# EAGLE design falcoln (EAGLE 9.1.2)

## Sheet 1 of 5: Battery Charger
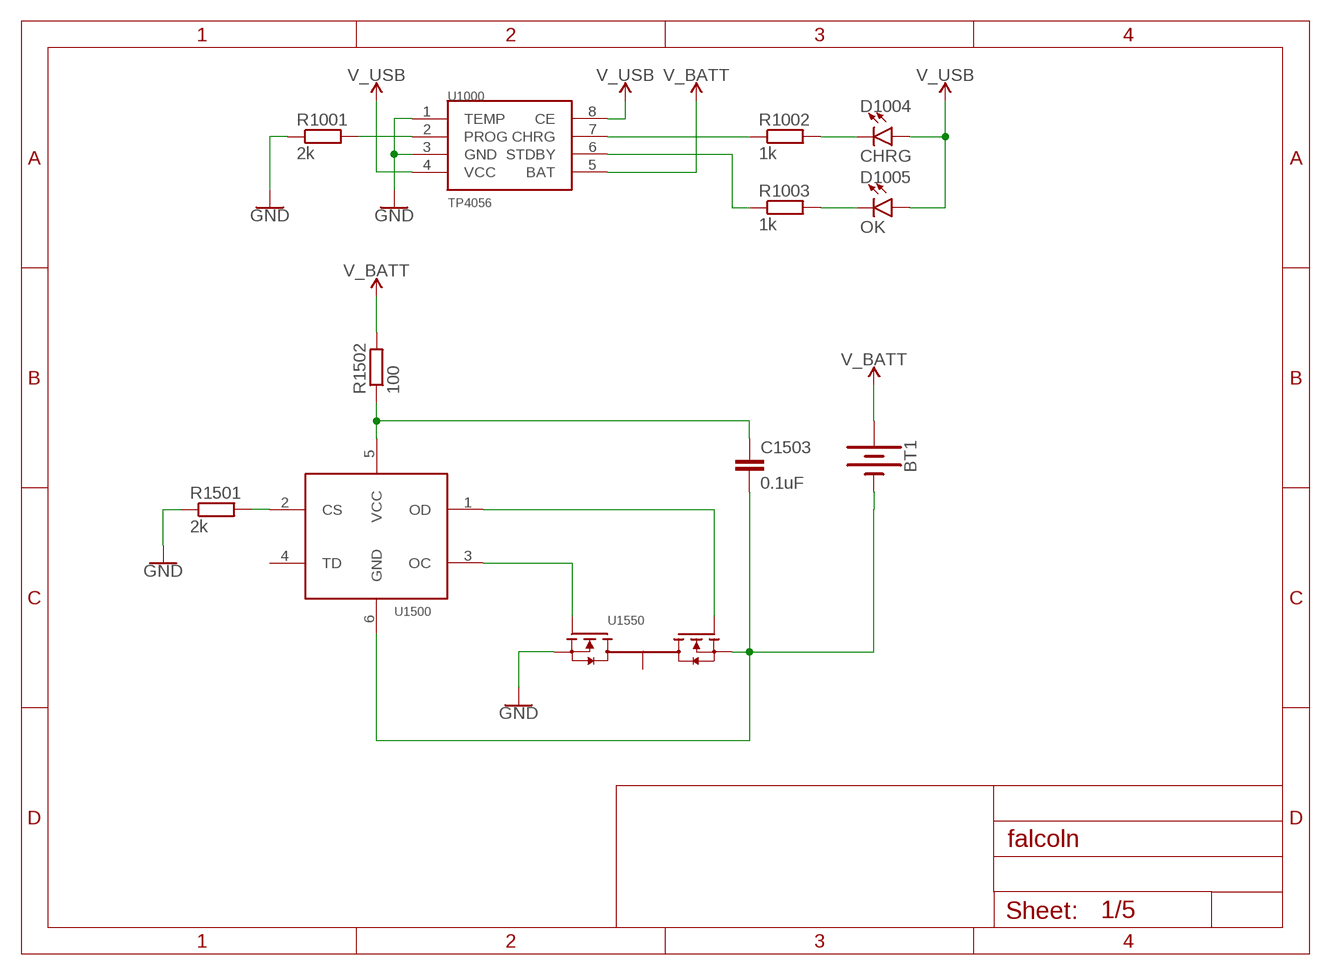
[diagram p0: schematic, sheet 1]

### Parts
BT1  BATTERY-18650  [BATTERY_18650-HOLDER]
C1503  0.1uF  C-EUC0603  [C0603]
D1004  CHRG  LED0603  [LED-0603]
D1005  OK  LED0603  [LED-0603]
R1001  2k  R-EU_R0603  [R0603]
R1002  1k  R-EU_R0603  [R0603]
R1003  1k  R-EU_R0603  [R0603]
R1501  2k  R-EU_R0603  [R0603]
R1502  100  R-EU_R0603  [R0603]
U1000  TP4056  [SOP-8]
U1500  FS312F-G  [SOT23-6]
U1550  FS8205  [SOT23-6]

### Nets
GND: R1001.1 R1501.1 U1000.1(TEMP) U1000.3(GND) U1550.1(S1) ; also sheet 2,3,4,5
N$1: U1500.3(OC) U1550.6(G1)
N$2: R1002.1 U1000.7(CHRG)
N$3: R1003.1 U1000.6(STDBY)
N$4: R1001.2 U1000.2(PROG)
N$5: BT1.GND@1(-) C1503.2 U1500.6(GND) U1550.3(S2)
N$6: D1005.C R1003.2
N$7: D1004.C R1002.2
N$8: U1500.1(OD) U1550.4(G2)
N$10: C1503.1 R1502.1 U1500.5(VCC)
N$11: R1501.2 U1500.2(CS)
V_BATT: BT1.PWR@1(+) R1502.2 U1000.5(BAT) ; also sheet 2,3
V_USB: D1004.A D1005.A U1000.4(VCC) U1000.8(CE) ; also sheet 5
Unconnected: U1500.4(TD) U1550.2(D12) U1550.5(D12)

## Sheet 2 of 5: Power Regulators
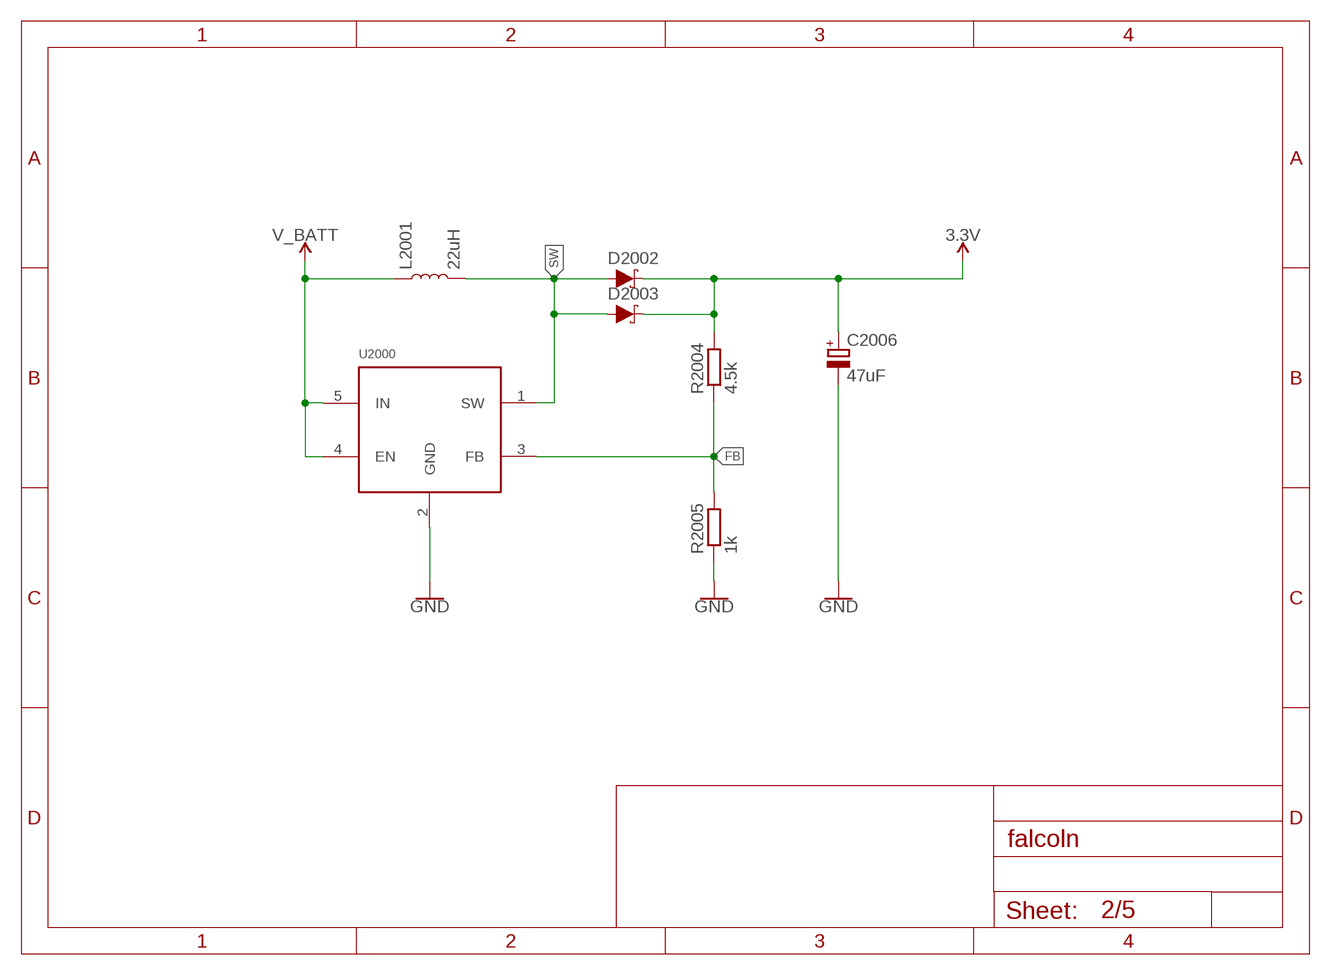
[diagram p1: schematic, sheet 2]

### Parts
C2006  47uF  CPOL-EUUD-5X5,8  [UD-5X5,8_NICHICON]
D2002  DIODE-SCHOTTKY-PMEG4005EJ  [SOD-323]
D2003  DIODE-SCHOTTKY-PMEG4005EJ  [SOD-323]
L2001  22uH  INDUCTOR-SRN6045-33UH  [SRN6045]
R2004  4.5k  R-EU_R0603  [R0603]
R2005  1k  R-EU_R0603  [R0603]
U2000  MT3608  [SOT23-6]

### Nets
3.3V: C2006.+ D2002.C D2003.C R2004.2 ; also sheet 3,4,5
FB: R2004.1 R2005.2 U2000.3(FB)
GND: C2006.- R2005.1 U2000.2(GND) ; also sheet 1,3,4,5
SW: D2002.A D2003.A L2001.2 U2000.1(SW)
V_BATT: L2001.1 U2000.4(EN) U2000.5(IN) ; also sheet 1,3

## Sheet 3 of 5: Processor
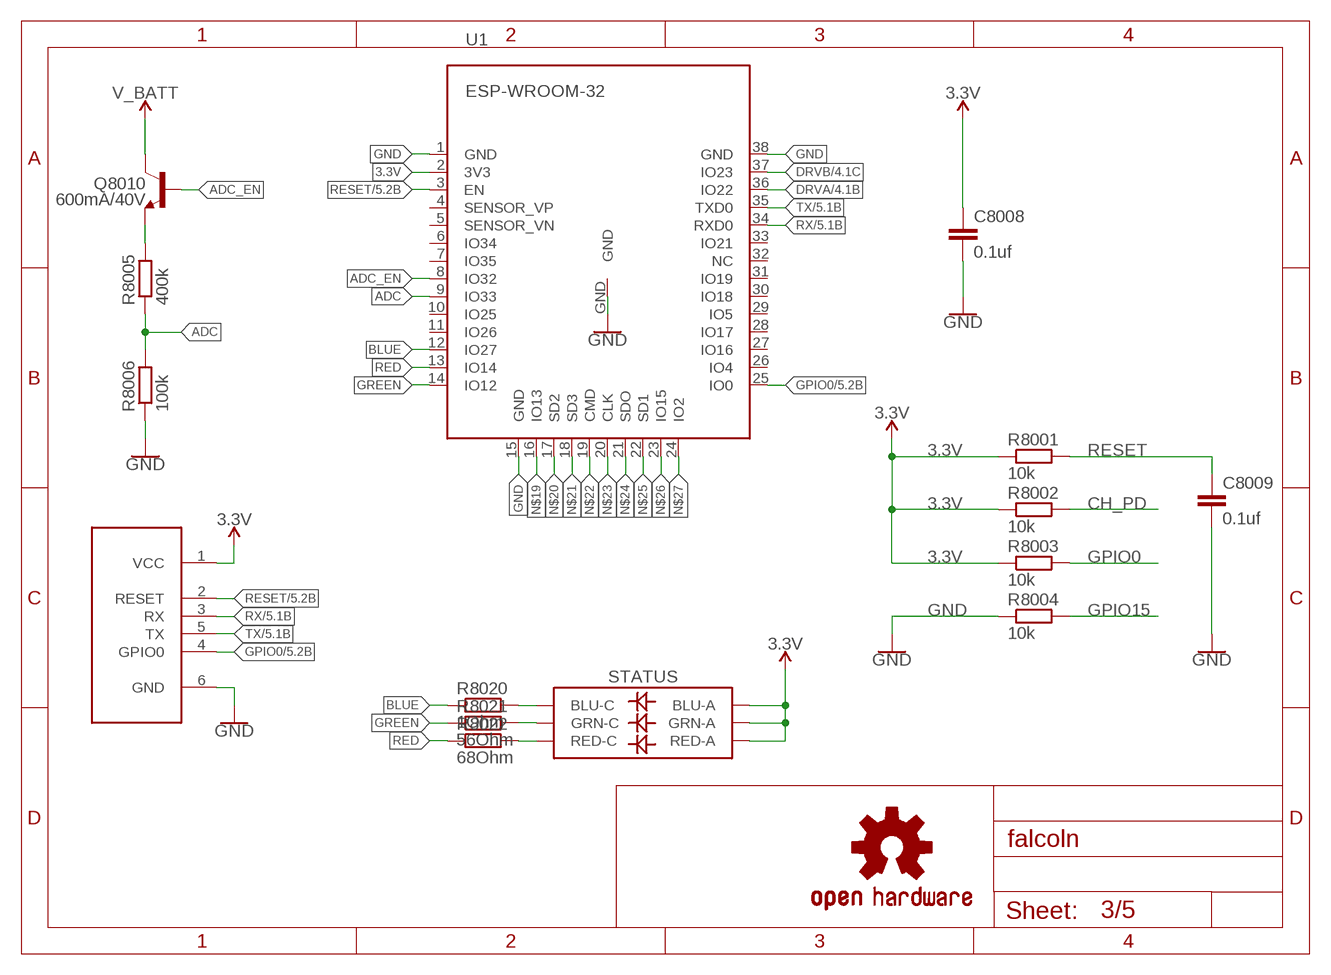
[diagram p2: schematic, sheet 3]

### Parts
C8008  0.1uf  C-EUC0603  [C0603]
C8009  0.1uf  C-EUC0603  [C0603]
LOGO1  OSHW-LOGOS  [OSHW-LOGO-S]
Q8010  600mA/40V  TRANS_NPN-MMBT2222AL  [SOT23-3]
R8001  10k  R-EU_R0603  [R0603]
R8002  10k  R-EU_R0603  [R0603]
R8003  10k  R-EU_R0603  [R0603]
R8004  10k  R-EU_R0603  [R0603]
R8005  400k  R-EU_R0603  [R0603]
R8006  100k  R-EU_R0603  [R0603]
R8020  1Ohm  R-EU_R0603  [R0603]
R8021  56Ohm  R-EU_R0603  [R0603]
R8022  68Ohm  R-EU_R0603  [R0603]
STATUS  LED-RGBNO_IC  [LED-TRICOLOR-5050]
U1  ESP-WROOM-32  [ESP-WROOM-32]
U$1  ESP8266_PROGRAMMER  [TC2030-IDC-NL]

### Nets
3.3V: C8008.1 R8001.1 R8002.1 R8003.1 STATUS.1(GRN-A) STATUS.2(RED-A) STATUS.3(BLU-A) U1.2(3V3) U$1.1(VCC) ; also sheet 2,4,5
ADC: R8005.1 R8006.2 U1.9(IO33)
ADC_EN: Q8010.1(B) U1.8(IO32)
BLUE: R8020.1 U1.12(IO27)
CH_PD: R8002.2
DRVA: U1.36(IO22) ; also sheet 4
DRVB: U1.37(IO23) ; also sheet 4
GND: C8008.2 C8009.2 R8004.1 R8006.1 U1.1(GND) U1.15(GND) U1.38(GND) U1.GND U$1.6(GND) ; also sheet 1,2,4,5
GPIO0: R8003.2 U1.25(IO0) U$1.4(GPIO0) ; also sheet 5
GPIO15: R8004.2
GREEN: R8021.1 U1.14(IO12)
N$9: Q8010.2(E) R8005.2
N$14: R8020.2 STATUS.4(BLU-C)
N$15: R8021.2 STATUS.6(GRN-C)
N$16: R8022.2 STATUS.5(RED-C)
N$19: U1.16(IO13)
N$20: U1.17(SD2)
N$21: U1.18(SD3)
N$22: U1.19(CMD)
N$23: U1.20(CLK)
N$24: U1.21(SDO)
N$25: U1.22(SD1)
N$26: U1.23(IO15)
N$27: U1.24(IO2)
RED: R8022.1 U1.13(IO14)
RESET: C8009.1 R8001.2 U1.3(EN) U$1.2(RESET) ; also sheet 5
RX: U1.34(RXD0) U$1.3(RX) ; also sheet 5
TX: U1.35(TXD0) U$1.5(TX) ; also sheet 5
V_BATT: Q8010.3(C) ; also sheet 1,2
Unconnected: U1.4(SENSOR_VP) U1.5(SENSOR_VN) U1.6(IO34) U1.7(IO35) U1.10(IO25) U1.11(IO26) U1.26(IO4) U1.27(IO16) U1.28(IO17) U1.29(IO5) U1.30(IO18) U1.31(IO19) U1.32(NC) U1.33(IO21)

## Sheet 4 of 5: Motor Driver
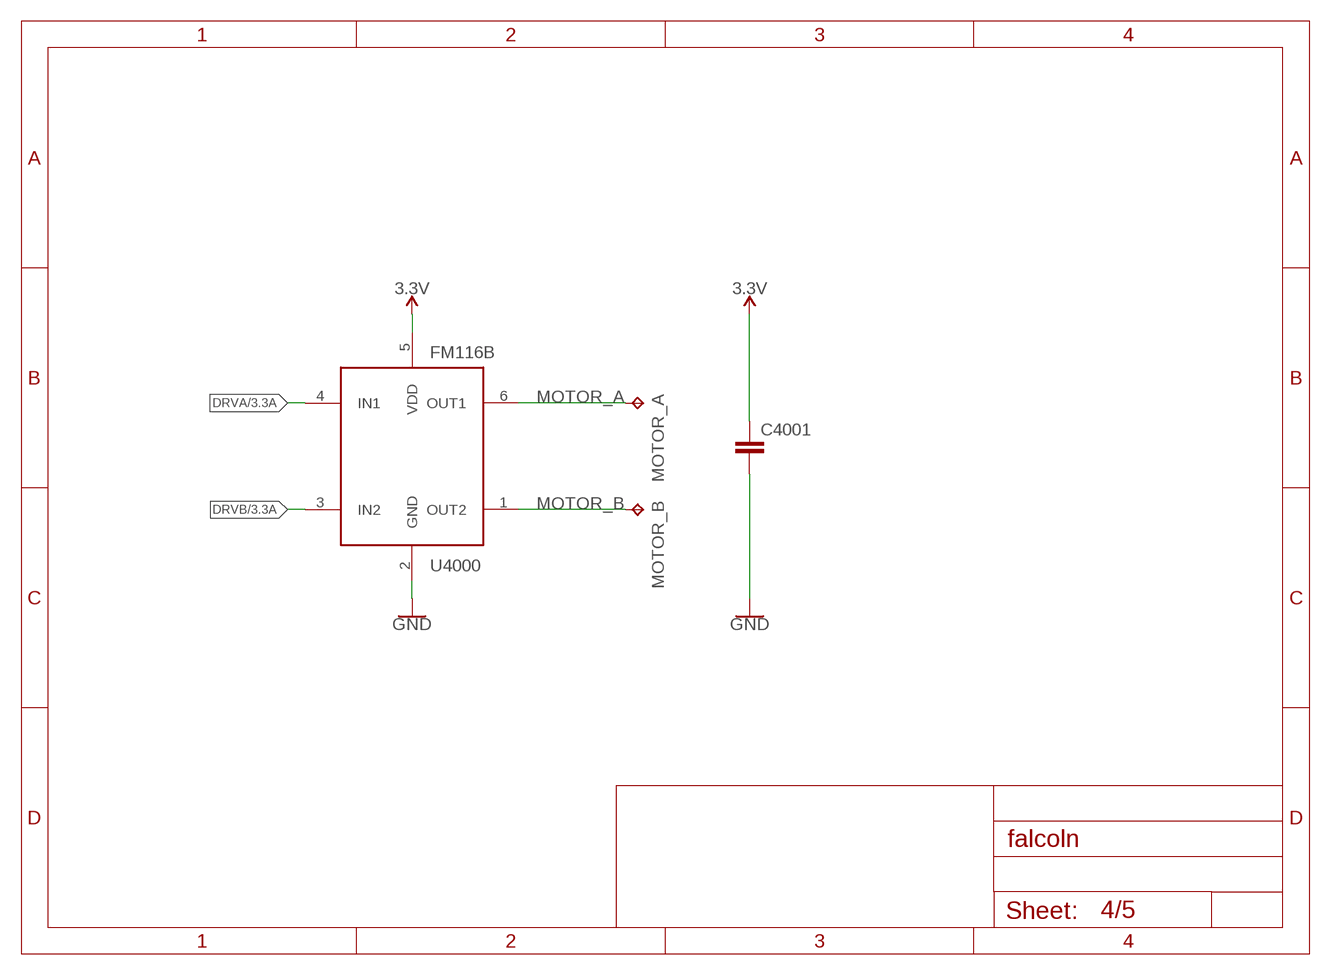
[diagram p3: schematic, sheet 4]

### Parts
C4001  C-EUC0603  [C0603]
MOTOR_A  TPTP20SQ  [TP20SQ]
MOTOR_B  TPTP20SQ  [TP20SQ]
U4000  FM116B  [SOT23-6]

### Nets
3.3V: C4001.1 U4000.5(VDD) ; also sheet 2,3,5
DRVA: U4000.4(IN1) ; also sheet 3
DRVB: U4000.3(IN2) ; also sheet 3
GND: C4001.2 U4000.2(GND) ; also sheet 1,2,3,5
MOTOR_A: MOTOR_A.TP U4000.6(OUT1)
MOTOR_B: MOTOR_B.TP U4000.1(OUT2)

## Sheet 5 of 5: USB/UART
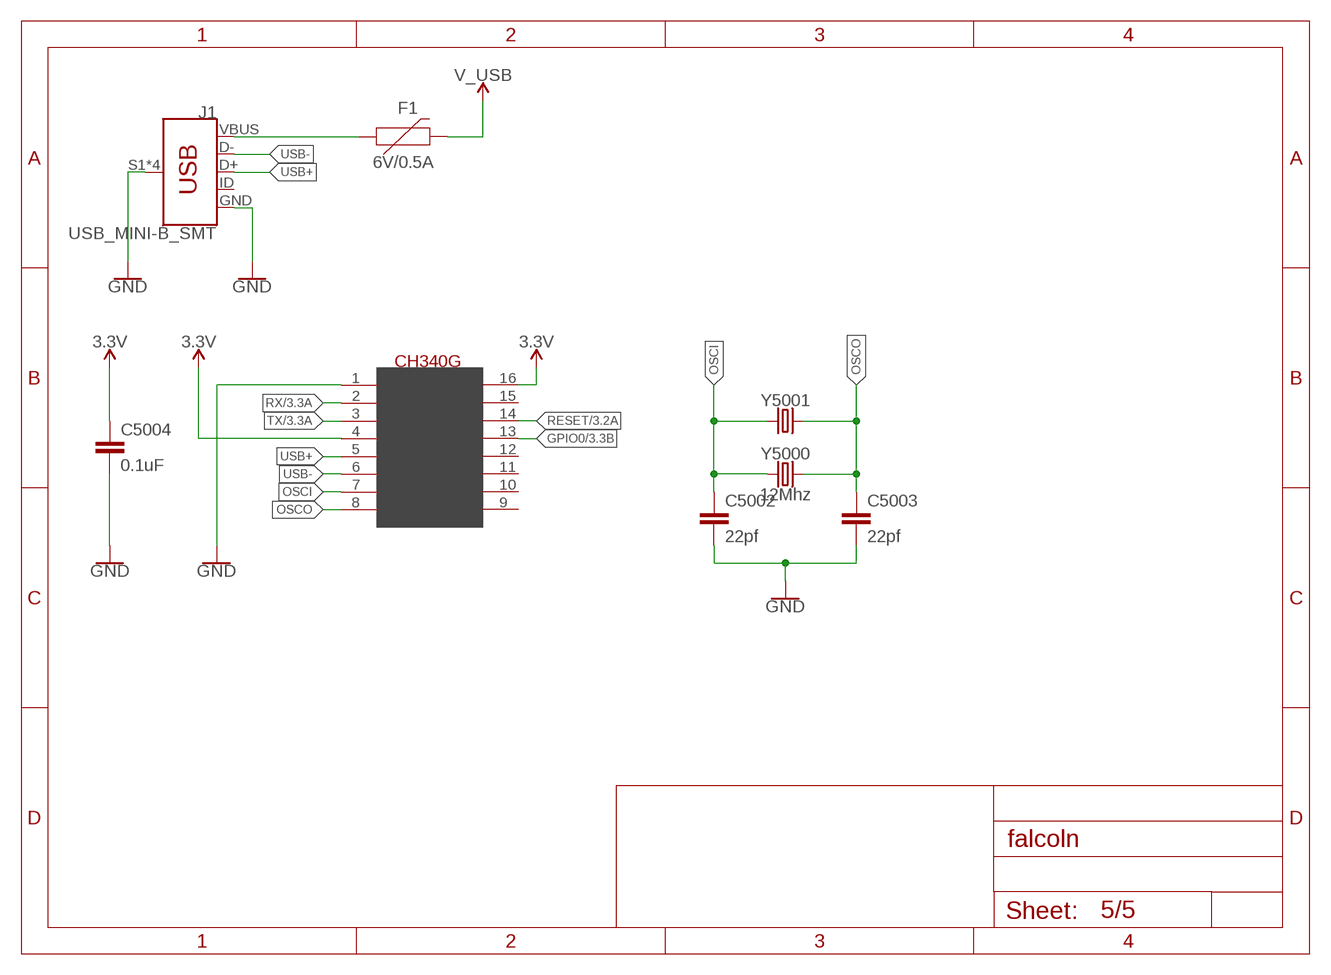
[diagram p4: schematic, sheet 5]

### Parts
C5002  22pf  C-EUC0603  [C0603]
C5003  22pf  C-EUC0603  [C0603]
C5004  0.1uF  C-EUC0603  [C0603]
F1  6V/0.5A  PPTC_HALF-AMP  [1206]
J1  USB_MINI-B_SMT  [USB-MINIB]
U5000  CH340G  [SOIC16]
Y5000  12Mhz  CRYSTALSMD-HC49UP  [HC49UP]
Y5001  CRYSTALPTH-HC49UV  [HC49U]

### Nets
3.3V: C5004.1 U5000.4(V3) U5000.16(VCC) ; also sheet 2,3,4
GND: C5002.2 C5003.2 C5004.2 J1.GND J1.S1(SHIELD) J1.S2(SHIELD) J1.S3(SHIELD) J1.S4(SHIELD) U5000.1(GND) ; also sheet 1,2,3,4
GPIO0: U5000.13(DTR) ; also sheet 3
OSCI: C5002.1 U5000.7(XI) Y5000.1 Y5001.1
OSCO: C5003.1 U5000.8(XO) Y5000.2 Y5001.2
RESET: U5000.14(RTS) ; also sheet 3
RX: U5000.2(TX) ; also sheet 3
TX: U5000.3(RX) ; also sheet 3
USB+: J1.D+ U5000.5(D+)
USB-: J1.D- U5000.6(D-)
V_USB: F1.2 ; also sheet 1
V_USB_UNFUSED: F1.1 J1.VBUS
Unconnected: J1.ID U5000.9(CTS) U5000.10(DSR) U5000.11(RI) U5000.12(DCD) U5000.15(RS232)

## Library data of the parts
BT1 = SparkFun-Batteries:BATTERY: Battery - Single Cell A variety of battery chemistries, sizes, and footprints. Device List: 20MM_PTH - Coin Cell Battery Holder - 20mm (PTH) <https://www.sparkfun.com/products/783> 6.8MM_PTH - Coin Cell Battery Holder - 6.8MM(SMD) <https://www.digikey.com/product-detail/en/seiko-instruments/MS621FE-FL11E/728-1057-ND/1889208?WT.srch=1&gclid=CNOQ5a6LzdQCFZS2wAodXCkE0g> 12MM_SMD - Coin Cell Battery Holder - 12mm (SMD) <https://www.sparkfun.com/products/10592> 12MM_PTH - Coin Cell Battery Holder - 12mm (PTH) <https://www.sparkfun.com/products/7948> 20MM_SMD - 20mm Coin Cell Battery Holder (SMD) (2 legs) Used on the Big Time Watch Kit <https://www.sparkfun.com/products/11734> 20MM_SMD_4LEGS - Coin Cell Battery Holder - 20mm (SMD) <https://www.sparkfun.com/products/11892> 20MM_SMD_4LEGS_OVERPASTE - Coin Cell Battery Holder - 20mm (SMD) <https://www.sparkfun.com/products/11892> (Over-paste on the legs) 24.5MM_PTH - Coin Cell Battery Holder - 24.5mm (PTH) <https://www.sparkfun.com/products/8863> 9V - 9V Battery Holder - PC Mount Used on the SparkFun SparkPunk Sound Kit <https://www.sparkfun.com/products/11177> and SparkFun SparkPunk Sequencer Kit <https://www.sparkfun.com/products/12707> 18650 - Battery Holder - 18650 (PTH) <https://www.sparkfun.com/products/13113> AA - Battery Holder - 1xAA (PTH) <https://www.sparkfun.com/products/7949> AAA - Battery Holder - 1xAAA (PTH) <https://www.sparkfun.com/products/12718> AA_KIT - Battery Holder - 1xAA (PTH) <https://www.sparkfun.com/products/7949> Special kit package - pads only have exposed copper on one side of the board. AAA_KIT - Battery Holder - 1xAAA (PTH) <https://www.sparkfun.com/products/12718> Special kit package - pads only have exposed copper on one side of the board.; PROD_ID: BATT-12327; SF_SKU: PRT-13113
C1503 C4001 C5002-C5004 C8008 C8009 = rcl:C-EU: CAPACITOR, European symbol; SPICEPREFIX: C
C2006 = rcl:CPOL-EU: POLARIZED CAPACITOR, European symbol; SPICEPREFIX: C
D1004 D1005 = SparkFun-LED:LED: LED (Generic) Standard schematic elements and footprints for 5mm, 3mm, 1206, and 0603 sized LEDs. Generic LEDs with no color specified.
D2002 D2003 = SparkFun-DiscreteSemi:DIODE-SCHOTTKY: Schottky diode A Schottky diode is a semiconductor diode which has a low forward voltage drop and a very fast switching action.; PROD_ID: DIO-10955; VALUE: 0.5A/40V/420mV
F1 = SparkFun-Fuses:PPTC: Resettable Fuse PPTC Resettable Fuse. Really a sort of resistor with a polymeric positive temperature coefficient whose resistance increases dramatically with an increase in temperature. When heated by the power passing through the resistance rises causing the current to be limited, protecting the circuit. This is achieved by the transition of the polymer from a crystalline to an amorphous state where the conductive carbon separates breaking the conductive pathways found in the cool crystalline structure. When a PPTC cools back down it resumes conducting letting the circuit turn back on. SparkFun Products: SparkFun RedBoard - Programmed with Arduino <https://www.sparkfun.com/products/12757> Pro Micro - 5V/16MHz <https://www.sparkfun.com/products/12640> Arduino Pro 328 - 5V/16MHz <https://www.sparkfun.com/products/10915> MP3 Trigger <https://www.sparkfun.com/products/13720>; PROD_ID: RES-08585
J1 = SparkFun-Connectors:USB_MINI-B: USB type Mini-B Connector Breaks out 5th pin, and includes shield pins if needed. SparkFun Products: SparkFun FTDI Basic Breakout <https://www.sparkfun.com/products/9716> SparkFun XBee Explorer USB <https://www.sparkfun.com/products/11812> SparkFun Redboard <https://www.sparkfun.com/products/12757>; PROD_ID: CONN-08193; SF_ID: PRT-00587
L2001 = SparkFun-Coils:INDUCTOR: Inductors Resist changes in electrical current. Basically a coil of wire. SparkFun Products: SparkFun Load Cell Amplifier - HX711 <https://www.sparkfun.com/products/13879> IOIO-OTG - V2.2 <https://www.sparkfun.com/products/13613>; PROD_ID: NDUC-11627; VALUE: 33µH/±20%/1.4A
LOGO1 = SparkFun-Aesthetics:OSHW-LOGO: Open-Source Hardware (OSHW) Logo This logo indicates the piece of hardware it is found on incorporates a OSHW license and/or adheres to the definition of open source hardware found here: http://freedomdefined.org/OSHW
MOTOR_A MOTOR_B = testpad:TP: Test pad
Q8010 = SparkFun-DiscreteSemi:TRANS_NPN: NPN transistor Current controlled devices typically used to amplify current or used as a switch. BC547 - COM-08928 <http://www.sparkfun.com/products/8928> (TO-92 45V 100mA) (1.Collector 2.Base 3.Emitter) 2N3904 - COM-00521 <http://www.sparkfun.com/products/521> (TO-92 40V 200mA) (1.Emitter 2.Base 3.Collector) P2N2222A - COM-12852 <http://www.sparkfun.com/products/12852> (TO-92 40V 600mA) (1.Collector 2.Base 3.Emitter); PROD_ID: TRANS-08049
R1001-R1003 R1501 R1502 R2004 R2005 R8001-R8006 R8020-R8022 = rcl:R-EU_: RESISTOR, European symbol; SPICEPREFIX: R
STATUS = SparkFun-LED:LED-RGB: LED-RGB 6 pin RGB LED (no common connector) Packages: PLCC-6 LED-TRICOLOR-5050 - No built-in IC SparkFun Products: Digital Sandbox <https://www.sparkfun.com/products/12651> LED- SMD RGB <https://www.sparkfun.com/products/10866>; PROD_ID: DIO-10298
U1 = esp32:ESP-WROOM-32
U1000 = geusebio:TP4056
U1500 = geusebio:FS312F-G
U1550 = geusebio:FS8205
U2000 = geusebio:MT3608
U4000 = geusebio:FM116B
U5000 = CH340G-USB-SERIAL:CH340G
U$1 = geusebio:ESP8266_PROGRAMMER
Y5000 Y5001 = SparkFun-Clocks:CRYSTAL: Crystals (Generic) These are passive quartz crystals, which can be used as a clock source for a microcontroller. Crystal's are two-terminal devices. They require external "load" capacitors to generate an oscillating signal.

## Board
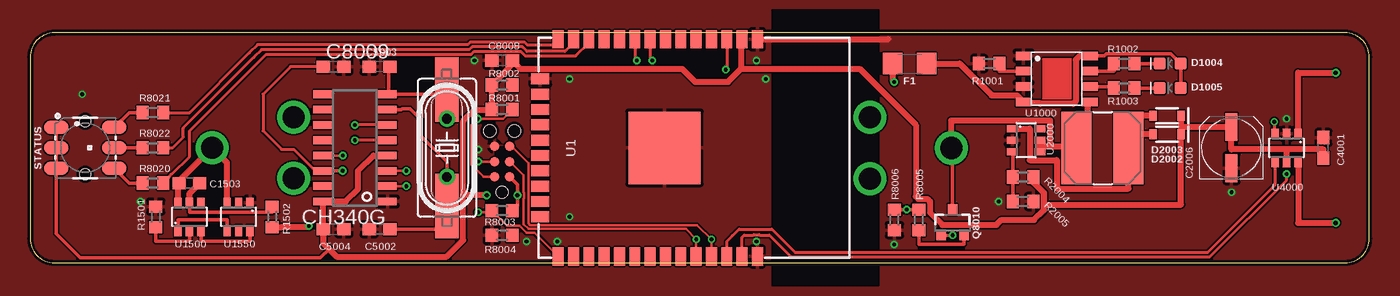
[diagram p5: board, top side]
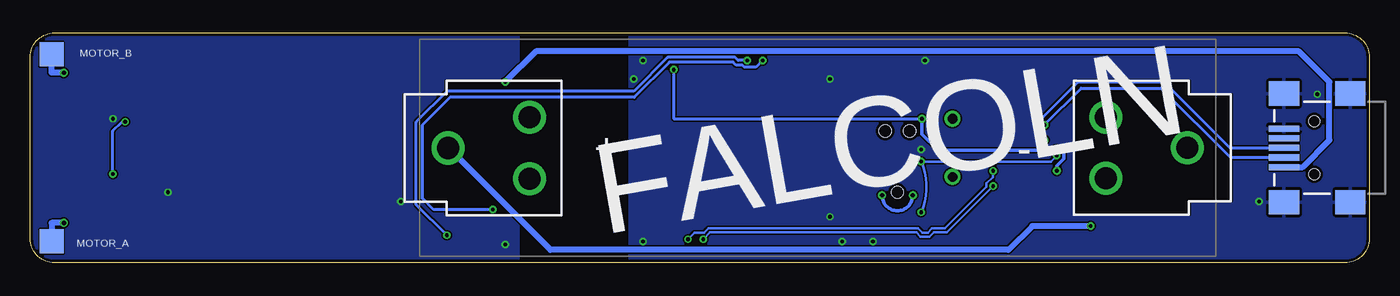
[diagram p6: board, bottom side, seen from below]

Size 111 x 19.05 mm. Coordinates in mm from the lower left corner, seen from the top.
Outline: 0,17.05 0,2 arc90 2,0 109,0 arc90 111,2 111,17.05 arc90 109,19.05 2,19.05 arc90 0,17.05
Copper layers (1*16): Top 0.035mm / dielectric 1.5mm / Bottom 0.035mm
Design rules "dirtypcbs": minimum track width 5mil, minimum drill 12mil, track to track 5mil, track to pad 5mil, pad to pad 5mil, via to via 5mil, smd to smd 0mil, copper to edge 10mil, drill to drill 10mil, minimum pad ring 10mil, minimum via ring 6mil, stop-mask expansion 2mil, vias tented up to drill 25mil, thermal gap 10mil
tKeepout: area 0,17.8 to 111,19; area 0,0 to 111,1.3
bKeepout: area 81,0 to 111,19.1

### Footprints (pad centres in the part's own frame; a part is rotated, then mirrored left to right if it is on the bottom)
BATTERY_18650-HOLDER = drill 1.829: GND@1 30.628,0.01; GND@2 23.88,2.55; GND@3 23.88,-2.53; PWR@1 -30.628,-0.01; PWR@2 -23.88,2.53; PWR@3 -23.88,-2.55
C0603 = smd 1.1 x 1: 1 -0.85,0; 2 0.85,0
UD-5X5,8_NICHICON = smd 2.3 x 1: + 1.725,0; - -1.7,0
LED-0603 = smd 1 x 1: A -0.877,0; C 0.877,0
SOD-323 = smd 0.63 x 0.83: A 1.15,0; C -1.15,0
1206 = smd 1.6 x 1.8: 1 -1.4,0; 2 1.4,0
USB-MINIB = smd 2.5 x 0.5: D+ 2.5,0; D- 2.5,0.8; GND 2.5,-1.6; ID 2.5,-0.8; VBUS 2.5,1.6 | smd 2.5 x 2: S1 -3,4.5; S2 2.5,4.5; S3 -3,-4.5; S4 2.5,-4.5 | hole 0.9: 0,2.2; 0,-2.2
SRN6045 = smd 2.5 x 6: 1 -2.175,0; 2 2.125,0
TP20SQ = smd 2 x 2: TP 0,0
SOT23-3 = smd 0.8 x 0.9: 1 -0.95,-1; 2 0.95,-1; 3 0,1.1
R0603 = smd 1 x 1.1: 1 -0.85,0; 2 0.85,0
LED-TRICOLOR-5050 = smd 2 x 1.1: 1 -2.4,1.7; 2 -2.4,0; 3 -2.4,-1.7; 4 2.4,-1.7; 5 2.4,0; 6 2.4,1.7
ESP-WROOM-32 = smd 0.9 x 1.5: 1 7.7,9; 2 6.43,9; 3 5.16,9; 4 3.89,9; 5 2.62,9; 6 1.35,9; 7 0.08,9; 8 -1.19,9; 9 -2.46,9; 10 -3.73,9; 11 -5,9; 12 -6.27,9; 13 -7.54,9; 14 -8.81,9; 25 -8.81,-9; 26 -7.54,-9; 27 -6.27,-9; 28 -5,-9; 29 -3.73,-9; 30 -2.46,-9; 31 -1.19,-9; 32 0.08,-9; 33 1.35,-9; 34 2.62,-9; 35 3.89,-9; 36 5.16,-9; 37 6.43,-9; 38 7.7,-9 | smd 1.5 x 0.9: 15 -10.3,5.715; 16 -10.3,4.445; 17 -10.3,3.175; 18 -10.3,1.905; 19 -10.3,0.635; 20 -10.3,-0.635; 21 -10.3,-1.905; 22 -10.3,-3.175; 23 -10.3,-4.445; 24 -10.3,-5.715 | smd 6 x 6: GND 0,0
SOP-8 = smd 1.3 x 0.7: 1 -2.75,1.905; 2 -2.75,0.635; 3 -2.75,-0.635; 4 -2.75,-1.905; 5 2.75,-1.905; 6 2.75,-0.635; 7 2.75,0.635; 8 2.75,1.905
SOT23-6 = smd 0.6 x 0.9: 1 -0.95,-1.15; 2 0,-1.15; 3 0.95,-1.15; 4 0.95,1.15; 5 0,1.15; 6 -0.95,1.15
SOIC16 = smd 0.635 x 1.524: 1 -4.445,-2.695; 2 -3.175,-2.695; 3 -1.905,-2.695; 4 -0.635,-2.695; 5 0.635,-2.695; 6 1.905,-2.695; 7 3.175,-2.695; 8 4.445,-2.695; 9 4.445,2.695; 10 3.175,2.695; 11 1.905,2.695; 12 0.635,2.695; 13 -0.635,2.695; 14 -1.905,2.695; 15 -3.175,2.695; 16 -4.445,2.695
TC2030-IDC-NL = smd 0.787 x 0.787: 1 -1.27,-0.635; 2 -1.27,0.635; 3 0,-0.635; 4 0,0.635; 5 1.27,-0.635; 6 1.27,0.635 | hole 0.991: -2.54,0; 2.54,1.016; 2.54,-1.016
HC49UP = smd 5.334 x 1.93: 1 -4.826,0; 2 4.826,0
HC49U = drill 0.813: 1 -2.413,0; 2 2.413,0

### Placement (x,y rotation side)
BT1  45.72,9.53 0 bottom
C1503  13.21,6.6 180 top
C2006  99.57,9.53 90 top
C4001  107.19,9.53 90 top
C5002  28.96,2.79 180 top
C5003  28.96,16.26 180 top
C5004  25.15,2.79 0 top
C8008  39.12,16.76 180 top
C8009  25.15,16.26 0 top
D1004  94.49,16.51 180 top
D1005  94.49,14.48 180 top
D2002  94.23,12.19 180 top
D2003  94.23,10.67 180 top
F1  72.9,16.51 0 top
J1  4.57,9.53 180 bottom
L2001  88.9,9.53 0 top
LOGO1  -15.24,90.17 0 top  (outside the outline)
MOTOR_A  109.22,1.78 0 bottom
MOTOR_B  109.22,17.27 0 bottom
Q8010  76.45,3.3 0 top
R1001  79.5,16.51 0 top
R1002  90.68,16.51 0 top
R1003  90.68,14.48 0 top
R1501  10.41,3.81 270 top
R1502  20.07,3.81 270 top
R2004  82.3,7.11 0 top
R2005  82.3,5.08 180 top
R8001  39.12,12.7 0 top
R8002  39.12,14.73 0 top
R8003  39.12,4.32 180 top
R8004  39.12,2.29 0 top
R8005  73.66,3.56 270 top
R8006  71.63,3.56 90 top
R8020  10.16,6.6 180 top
R8021  10.16,12.45 180 top
R8022  10.16,9.53 180 top
STATUS  4.57,9.53 0 top
U1  52.58,9.53 0 top
U1000  85.09,15.24 0 top
U1500  13.21,3.81 0 top
U1550  17.27,3.81 180 top
U2000  82.55,10.16 270 top
U4000  104.14,9.53 180 top
U5000  26.92,9.53 90 top
U$1  39.12,8.38 90 top
Y5000  34.54,9.53 90 top
Y5001  34.54,9.53 90 top

### Tracks (layer width: path | path; a pad name or v marks a point on that pad's centre or on a via)
3.3V  (via drill 0.35)
  Top 0.254: U$1.1 39.86,7
  Top 0.305: R8003.1 40.39,4.74 v40.39,5.59 40.39,6.48 39.86,7 | STATUS.1 STATUS.2 STATUS.3 2.17,2.4 4.17,0.41 24.03,0.41 24.77,1.14
  Top 0.508: D2002.C 95.38,11.18 | 95.38,11.18 D2003.C 95.38,4.83 84.03,4.83 84.03,5.79 | 35.89,5.59 35.89,1.87 34.52,0.51 25.4,0.51 24.77,1.14 24.3,1.61 C5004.1 24.3,5.01 U5000.16 26.16,5.08 27.18,6.1 27.18,7.62 28.45,8.89 U5000.4 | v37.85,5.59 35.89,5.59 | 35.89,5.59 35.89,11.76 36.83,12.7 R8001.1 R8002.1 39.97,16.43 C8008.1 40.66,16.07 54.03,16.07 55.12,14.99 57.84,14.99 58.93,16.07 | R2004.2 83.15,6.67 84.03,5.79 | 84.03,5.79 84.03,4.37 83.21,3.56 80.52,3.56 80.09,3.13 75.61,3.13 74.59,4.15 74.59,5.06 74.37,5.29 73.62,5.29 73.41,5.5 73.41,11.43 68.77,16.07 58.93,16.07 | U1.2 58.93,18.52 58.93,16.07 | 95.38,11.18 95.38,11.25 C2006.+ 99.57,9.4 104.14,9.4 | U4000.5 104.14,9.4 | C4001.1 107.19,9.4 104.14,9.4
  Bottom 0.305: v37.85,5.59 arc180 v40.39,5.59
ADC  (via drill 0.3)
  Top 0.254: U1.9 50.12,16.94 v50.29,16.76
  Top 0.305: R8005.1 v72.64,4.41 R8006.2
  Bottom 0.254: v50.29,16.76 50.85,16.2 51.79,16.2 51.97,16.38 52.48,16.38 52.74,16.64 58.01,16.64 60.93,13.72 76.2,13.72 78.49,11.43 78.49,5.33 77.56,4.41 76.96,4.41 | v72.64,4.41 76.96,4.41 | 76.96,4.41
ADC_EN  (via drill 0.3)
  Top 0.254: U1.8 51.39,16.94 v51.56,16.76 | Q8010.1 75.52,2.29 v76.45,2.29
  Bottom 0.254: v51.56,16.76 52.32,16.76 52.58,17.02 58.17,17.02 60.96,14.22 76.45,14.22 78.99,11.68 78.99,4.83 v76.45,2.29
BLUE
  Top 0.254: U1.12 46.31,18.24 45.21,17.14 41.03,17.14 40.65,17.52 36.79,17.52 36.55,17.27 19.56,17.27 13.21,10.92 13.21,8.8 11.76,7.36 11.7,7.36 11.55,7.21 11.55,7.15 R8020.1
DRVA
  Top 0.254: U4000.4 103.19,6.45 97.63,0.89 63.37,0.89 61.47,2.79 58.75,2.79 58.21,2.25 57.74,1.78 U1.36
DRVB  (via drill 0.3)
  Top 0.254: U1.37 59.01,2.11 59.18,2.29 59.92,2.29 59.97,2.34 60.43,2.34 60.48,2.29 61.28,2.29 63.06,0.51 97.79,0.51 104.14,6.86 v104.14,7.37 | v103.12,11.68 103.12,10.74 U4000.3
  Bottom 0.254: v104.14,7.37 104.14,10.92 103.38,11.68 v103.12,11.68
FB
  Top 0.305: U2000.3 81.45,9.21 R2004.1 R2005.2
GND  (via drill 0.3)
  Top 0.508: U1.1 71.14,18.52
  other vias: 44.7,15.24 36.83,16.76 41.15,1.78 43.69,1.78 9.14,5.08 4.32,13.97 60.2,16.76 60.2,1.78 80.26,5.08 71.63,1.52 44.7,3.81 37.13,9.4 104.14,11.94 99.57,5.84 60.96,15.24
  pour Top: -7.62,37.08 123.44,37.08 123.44,-16.76 -7.62,-16.76
  pour Bottom: -5.59,35.05 126.49,35.05 126.49,-19.56 -5.33,-19.56 -5.33,34.8
GPIO0  (via drill 0.3)
  Top 0.203: U1.25 41.82,2.47 41.15,2.47 40.56,3.06 39.52,3.06 R8003.2 38.14,4.19 v37.13,4.19 | U$1.4 37.34,8.38 v37.13,8.38 | v25.91,8.89 U5000.13
  Bottom 0.203: v25.91,8.89 26.42,8.38 v37.13,8.38 arc45 v37.13,4.19
GREEN
  Top 0.254: R8021.1 13.21,12.45 18.16,17.4 18.84,18.08 36.28,18.08 36.48,18.28 40.96,18.28 41.21,18.03 43.28,18.03 U1.14
MOTOR_A  (via drill 0.35)
  Top 0.508: U4000.6 105.09,3.3 v108.2,3.3
  Bottom 0.508: v108.2,3.3 109.22,3.3 MOTOR_A.TP
MOTOR_B  (via drill 0.35)
  Top 0.508: U4000.1 105.09,15.75 v108.2,15.75
  Bottom 0.508: v108.2,15.75 109.22,15.75 MOTOR_B.TP
N$1
  Top 0.305: U1500.3 14.16,1.78 18.22,1.78 U1550.6
N$2
  Top 0.305: U1000.7 89.83,15.88 R1002.1
N$3
  Top 0.305: U1000.6 89.83,14.61 R1003.1
N$4
  Top 0.305: U1000.2 80.35,15.88 R1001.2
N$5
  Top 0.508: U1500.6 12.26,6.5 C1503.2 12.36,6.8 12.94,7.38 BT1.GND@1 16.32,8.3 U1550.3
N$6
  Top 0.305: R1003.2 D1005.C
N$7
  Top 0.305: R1002.2 D1004.C
N$8
  Top 0.305: U1500.1 12.26,3.56 16.32,3.56 U1550.4
N$9
  Top 0.305: R8005.2 73.66,1.52 77.4,1.52 Q8010.2
N$10
  Top 0.305: U1500.5 13.21,4.21 20.07,4.21 R1502.1
  Top 0.508: U1500.5 13.21,5.75 C1503.1
N$11
  Top 0.305: U1500.2 13.21,1.78 10.41,1.78 R1501.2
N$14
  Top 0.305: STATUS.4 8.19,6.6 R8020.2
N$15
  Top 0.305: STATUS.6 8.19,12.45 R8021.2
N$16
  Top 0.305: STATUS.5 R8022.2
OSCI
  Top 0.305: Y5000.1 34.54,5.08 | 34.54,5.08 Y5001.1 34.54,8.38 32.42,10.5 32.42,11.85 31.5,12.78 30.81,12.78 30.73,12.7 U5000.7 | C5002.1 34.54,2.79 34.54,5.08
OSCO
  Top 0.305: Y5000.2 34.54,13.97 | 34.54,13.97 Y5001.2 | U5000.8 29.72,13.97 | 29.72,13.97 34.54,13.97 | C5003.1 29.72,16.26 29.72,13.97
RED
  Top 0.254: R8022.1 11.81,9.53 12.7,10.41 12.7,11.18 18.54,17.02 19.18,17.65 36.39,17.65 36.64,17.9 40.81,17.9 41.18,17.52 44.32,17.52 45.04,18.24 U1.13
RESET  (via drill 0.3, 0.35)
  Top 0.203: R8001.2 39.19,11.92 37.67,11.92 37.66,11.94 v37.08,11.94 36.53,11.38 36.53,8.15 37.57,7.11 38.34,7.11 38.41,7.04
  Top 0.254: U1.3 57.74,16 v57.66,16 | U$1.2 38.41,7.04 | C8009.1 21.59,16.26 19.3,13.97 19.3,10.92 20.83,9.4 21.84,9.4 23.62,7.62 U5000.14
  Top 0.305: U5000.14 v25.91,7.62
  Bottom 0.254: v57.66,16 57.66,11.94 v37.08,11.94
  Bottom 0.305: v25.91,7.62 25.91,8.03 25.3,8.64 25.3,9.14 25.74,9.58 26.08,9.58 26.33,9.32 35.74,9.32 37.08,10.67 v37.08,11.94
RX  (via drill 0.3)
  Top 0.203: U1.34 v55.2,1.95 54.35,2.8 41.3,2.8 40.89,3.2 40.89,5.31 40.94,5.36 40.94,5.82 40.89,5.87 40.89,7.24 39.85,8.28 39.85,8.38 | U5000.2 v31.19,6.35
  Top 0.254: U$1.3 39.85,8.38
  Bottom 0.203: v31.19,6.35 35.03,2.52 36.11,2.52 36.46,2.16 37.2,2.16 37.55,2.52 54.63,2.52 v55.2,1.95
SW
  Top 0.508: U2000.1 82.84,11.11 82.84,8.5 85.09,8.5 85.09,6.14 91.03,6.14 L2001.2 91.03,10.41 | D2003.A 91.03,10.67 91.03,10.41 | D2002.A 91.03,12.19 91.03,10.41
TX  (via drill 0.3)
  Top 0.203: U1.35 v56.47,1.95 55.29,3.13 41.43,3.13 41.3,3.27 41.3,8.25 39.82,9.72 | U5000.3 v31.19,7.62
  Top 0.254: U$1.5 39.82,9.72
  Bottom 0.203: v31.19,7.62 31.19,7.1 31.73,6.57 31.73,6.28 35.16,2.85 36.25,2.85 36.6,2.49 37.06,2.49 37.41,2.85 54.77,2.85 55.13,2.48 55.94,2.48 v56.47,1.95
USB+  (via drill 0.3)
  Top 0.254: U5000.5 v26.92,10.16
  Bottom 0.254: J1.D+ 11.56,9.53 17.02,14.99 24.13,14.99 27.13,11.99 27.16,11.99 27.48,11.66 27.48,10.72 v26.92,10.16
USB-  (via drill 0.3)
  Top 0.254: U5000.6 v26.92,11.43
  Bottom 0.254: v26.92,11.43 23.88,14.48 17.27,14.48 11.52,8.72 J1.D-
V_BATT  (via drill 0.3)
  Top 0.305: BT1.PWR@1 76.45,9.52 Q8010.3
  Top 0.508: U2000.4 83.7,9.65 | 83.7,9.65 U2000.5 | 86.72,9.65 86.72,10.41 87.63,10.41 87.63,13.34 U1000.5 | 83.7,9.65 84.58,9.65 | 84.58,9.65 86.72,9.65 | 86.72,9.65 L2001.1 | 84.58,9.65 84.53,9.65 84.53,11.79 76.35,11.79 BT1.PWR@1 | R1502.2 20.83,2.96 23.03,2.96 v23.11,3.05
  Bottom 0.508: v23.11,3.05 27.95,3.05 29.93,1.07 67.87,1.07 76.32,9.52 BT1.PWR@1
V_USB
  Top 0.305: D1005.A D1004.A 94.54,17.34 89.21,17.34 89.02,17.14 U1000.8
  Top 0.508: F1.2 77.06,16.51 79.7,13.87 81.8,13.87 U1000.4 82.47,13.21 83.68,13.21 83.73,13.16 86.45,13.16 86.67,13.38 86.67,16.82 87,17.14 U1000.8
V_USB_UNFUSED  (via drill 0.3)
  Top 0.508: v71.63,14.99 71.5,15.12 F1.1
  Bottom 0.508: J1.VBUS 5.54,7.92 3.3,10.16 3.3,14.99 5.84,17.53 69.09,17.53 v71.63,14.99

### Text on the board
bNames: FALCOLN